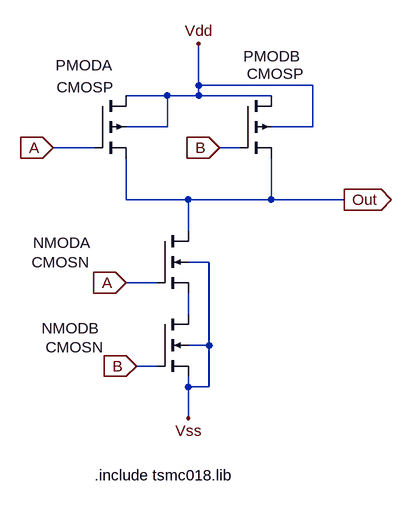
[diagram p0: schematic NAND1.asc]
NAND1.asc, the LTspice schematic file:
Version 4
SHEET 1 880 680
WIRE 336 -112 336 -176
WIRE 512 -112 336 -112
WIRE 288 -96 224 -96
WIRE 336 -96 336 -112
WIRE 336 -96 288 -96
WIRE 448 -96 336 -96
WIRE 288 -48 288 -96
WIRE 288 -48 224 -48
WIRE 512 -48 512 -112
WIRE 512 -48 448 -48
WIRE 176 -16 112 -16
WIRE 400 -16 368 -16
WIRE 224 64 224 0
WIRE 320 64 224 64
WIRE 448 64 448 0
WIRE 448 64 320 64
WIRE 560 64 448 64
WIRE 320 112 320 64
WIRE 352 160 320 160
WIRE 272 192 224 192
WIRE 320 240 320 208
WIRE 352 288 352 160
WIRE 352 288 320 288
WIRE 272 320 240 320
WIRE 320 352 320 336
WIRE 352 352 352 288
WIRE 352 352 320 352
WIRE 320 400 320 352
FLAG 112 -16 A
IOPIN 112 -16 In
FLAG 224 192 A
IOPIN 224 192 In
FLAG 368 -16 B
IOPIN 368 -16 In
FLAG 240 320 B
IOPIN 240 320 In
FLAG 560 64 Out
IOPIN 560 64 Out
FLAG 320 400 Vss
FLAG 336 -176 Vdd
SYMBOL pmos4 176 -96 R0
WINDOW 0 -60 -47 Left 2
WINDOW 3 -59 -13 Left 2
SYMATTR InstName PMODA
SYMATTR Value CMOSP
SYMATTR Value2 l=1u w=2u
SYMBOL pmos4 400 -96 R0
WINDOW 0 5 -61 Left 2
WINDOW 3 10 -34 Left 2
SYMATTR InstName PMODB
SYMATTR Value CMOSP
SYMATTR Value2 l=1u w=2u
SYMBOL nmos4 272 112 R0
WINDOW 0 -191 18 Left 2
WINDOW 3 -193 48 Left 2
SYMATTR InstName NMODA
SYMATTR Value CMOSN
SYMATTR Value2 l=1u w=1u
SYMBOL nmos4 272 240 R0
WINDOW 0 -178 22 Left 2
WINDOW 3 -172 51 Left 2
SYMATTR InstName NMODB
SYMATTR Value CMOSN
SYMATTR Value2 l=1u w=1u
TEXT 176 488 Left 2 !.include tsmc018.lib

The netlist it stands for:
* NAND1.asc
M§PMODA Vdd A Out Vdd CMOSP l=1u w=2u
M§PMODB Vdd B Out Vdd CMOSP l=1u w=2u
M§NMODA Out A N001 Vss CMOSN l=1u w=1u
M§NMODB N001 B Vss Vss CMOSN l=1u w=1u
.model NMOS NMOS
.model PMOS PMOS
.lib standard.mos
.include tsmc018.lib
.backanno
.end